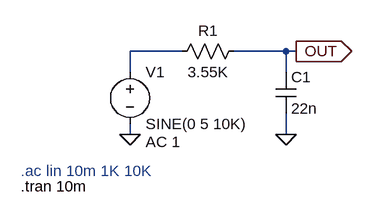
[diagram p0: schematic Low Pass Filter.asc]
Low Pass Filter.asc, the LTspice schematic file:
Version 4
SHEET 1 880 680
WIRE 128 112 48 112
WIRE 288 112 208 112
WIRE 304 112 288 112
WIRE 48 144 48 112
WIRE 288 144 288 112
WIRE 48 240 48 224
WIRE 288 240 288 208
FLAG 48 240 0
FLAG 288 240 0
FLAG 304 112 OUT
IOPIN 304 112 Out
SYMBOL res 224 96 R90
WINDOW 0 0 56 VBottom 2
WINDOW 3 32 56 VTop 2
SYMATTR InstName R1
SYMATTR Value 3.55K
SYMBOL cap 272 144 R0
SYMATTR InstName C1
SYMATTR Value 22n
SYMBOL voltage 48 128 R0
WINDOW 123 24 124 Left 2
WINDOW 39 0 0 Left 0
SYMATTR Value2 AC 1
SYMATTR InstName V1
SYMATTR Value SINE(0 5 10K)
TEXT -120 296 Left 2 ;.ac lin 10m 1K 10K
TEXT -120 320 Left 2 !.tran 10m

The netlist it stands for:
* Low Pass Filter.asc
R1 OUT N001 3.55K
C1 OUT 0 22n
V1 N001 0 SINE(0 5 10K) AC 1
* .ac lin 10m 1K 10K
.tran 10m
.backanno
.end